# EAGLE design pcb_reguladores (EAGLE 9.6.2)
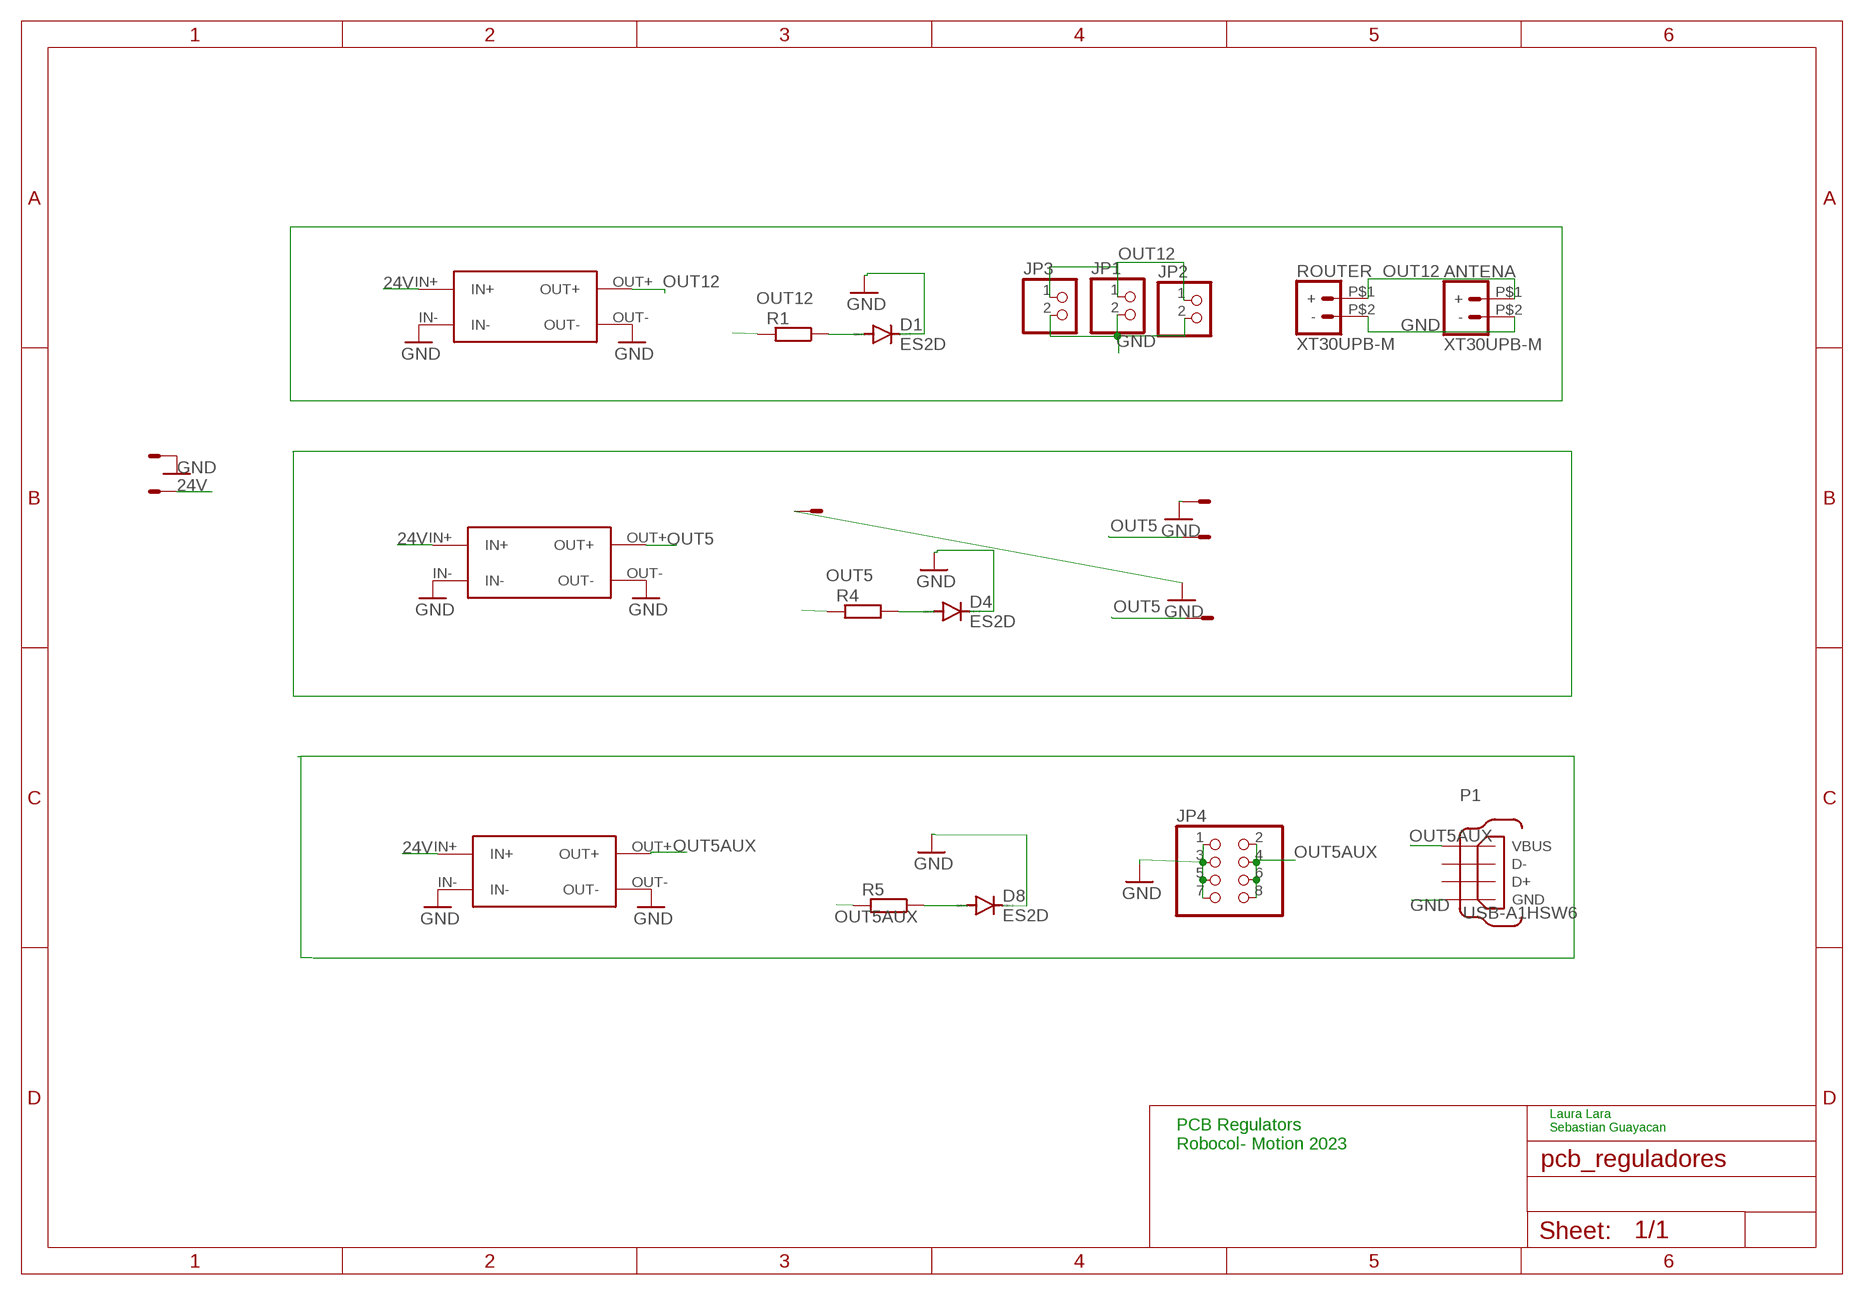
[diagram p0: schematic, sheet 1]

## Parts
ANTENA  XT30UPB-M  [XT30UPB-M]
D1  ES2D  [SMB]
D4  ES2D  [SMB]
D8  ES2D  [SMB]
JP1  PINHD-1X2  [1X02]
JP2  PINHD-1X2  [1X02]
JP3  PINHD-1X2  [1X02]
JP4  PINHD-2X4  [2X04]
P1  USB-A1HSW6  [OST_USB-A1HSW6]
R1  SMK  [SMK]
R4  SMK  [SMK]
R5  SMK  [SMK]
REG5AUX  XL4015_5A  [XL4015_PADS]
REG5V  XL4015_5A  [XL4015_PADS]
REG12V  XL4015_5A  [XL4015_PADS]
ROUTER  XT30UPB-M  [XT30UPB-M]
V_IN  5566-25569-2  [5569-2]
X1  5566-25569-2  [5569-2]
X3  5566-25569-2  [5569-2]

## Nets
24V: REG5AUX.IN+ REG5V.IN+ REG12V.IN+ V_IN.2
GND: ANTENA.P$2(-) D1.C D4.C D8.C JP4.1 JP4.3 JP4.5 JP4.7 P1.4(GND) REG5AUX.IN- REG5AUX.OUT- REG5V.IN- REG5V.OUT- REG12V.IN- REG12V.OUT- ROUTER.P$2(-) V_IN.1 X1.1 X3.1
N$6: JP1.2 JP2.2 JP3.2
N$8: D4.A R4.1
N$13: D1.A R1.1
N$20: D8.A R5.1
OUT5: R4.2 REG5V.OUT+ X1.2 X3.2
OUT5AUX: JP4.2 JP4.4 JP4.6 JP4.8 P1.1(VBUS) R5.2 REG5AUX.OUT+
OUT12: ANTENA.P$1(+) JP1.1 JP2.1 JP3.1 R1.2 REG12V.OUT+ ROUTER.P$1(+)
Unconnected: P1.2(D-) P1.3(D+)

## Notes on the sheet
- Laura Lara
  Sebastian Guayacan
- PCB Regulators 
  Robocol- Motion 2023

## Library data of the parts
ANTENA ROUTER = XT30UPB-M:XT30UPB-M: Check availability <https://pricing.snapeda.com/parts/XT30UPB-M/amass/view-part?ref=eda>; AVAILABILITY: Not in stock; DESCRIPTION: Socket; DC supply; XT30; male; PIN: 2; on PCBs; THT; yellow; 15A; 500V; MF: amass; MP: XT30UPB-M; PACKAGE: None; PRICE: None
D1 D4 D8 = diode:ES2D: DIODE super fast rectifier, 2 A
JP1-JP3 = pinhead:PINHD-1X2: PIN HEADER
JP4 = pinhead:PINHD-2X4: PIN HEADER
P1 = USB-A1HSW6:USB-A1HSW6: USB - A Receptacle Connector 4 Position Through Hole, Right Angle Check availability <https://pricing.snapeda.com/parts/USB-A1HSW6/On%20Shore/view-part?ref=eda>; AVAILABILITY: In Stock; DESCRIPTION: USB-A (USB TYPE-A) - Receptacle Connector 4 Position Through Hole, Right Angle; MF: On Shore; MP: USB-A1HSW6; PACKAGE: None; PRICE: None; PURCHASE-URL: https://pricing.snapeda.com/search/part/USB-A1HSW6/?ref=eda
R1 R4 R5 = resistor-shunt:SMK: SMD SHUNT RESISTOR; OC_FARNELL: unknown; OC_NEWARK: unknown
REG5AUX REG5V REG12V = Robocol_Eagle_Libraries2:XL4015_5A: XL4015 DC-DC Adjustable PSU Module Reference: XL4015 Type: Buck converter. Description: Buck converte step down regulator with up to 5A. Regulador type: Step down. Rated Current: 5A (with heatsink) Voltage in: 8 to 36 VDC Voltage out: 1.23 to 32 VDC Efficiency: Up to 96%. Dimensions: 43.6mm x 21mm x 14mm. Author: Franz Luepke. Year: 2021 Made for use in: Robocol Uniandes.
V_IN X1 X3 = molex_arreglo:5566-2: Mini FIT connector 2 pol Source: http://www.molex.com

## Board
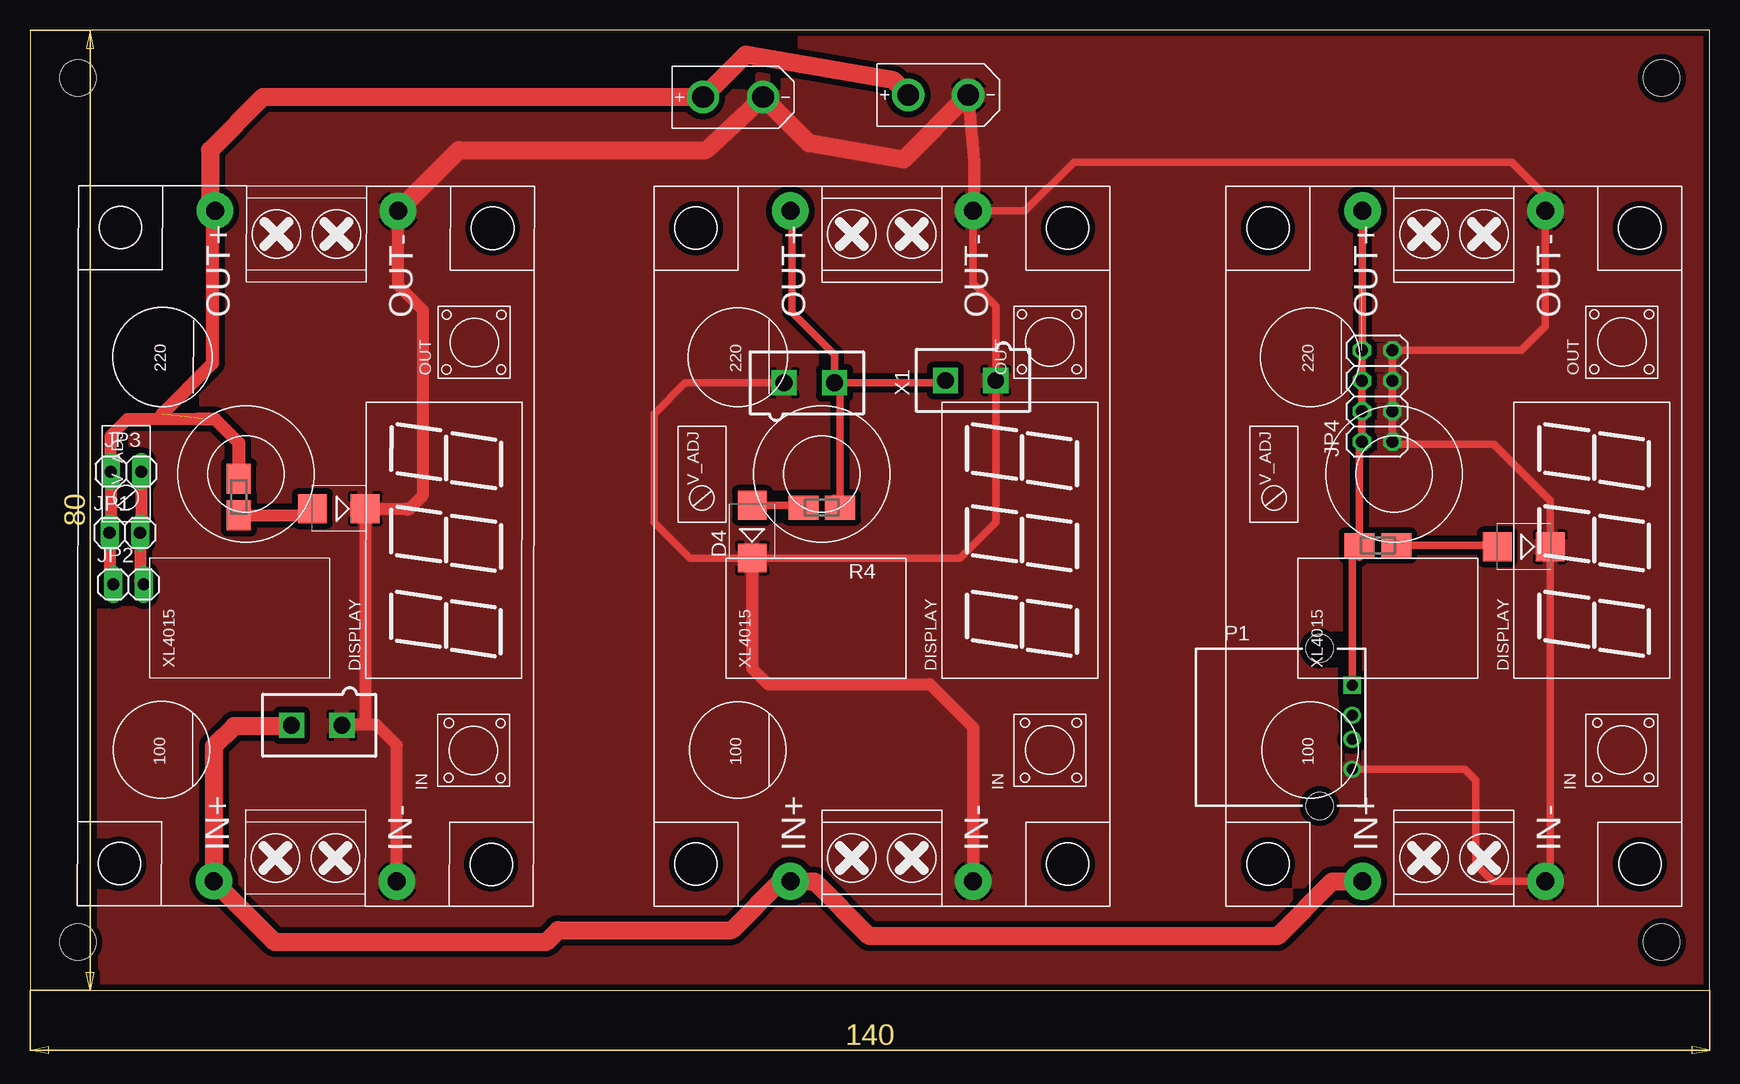
[diagram p1: board, top side]
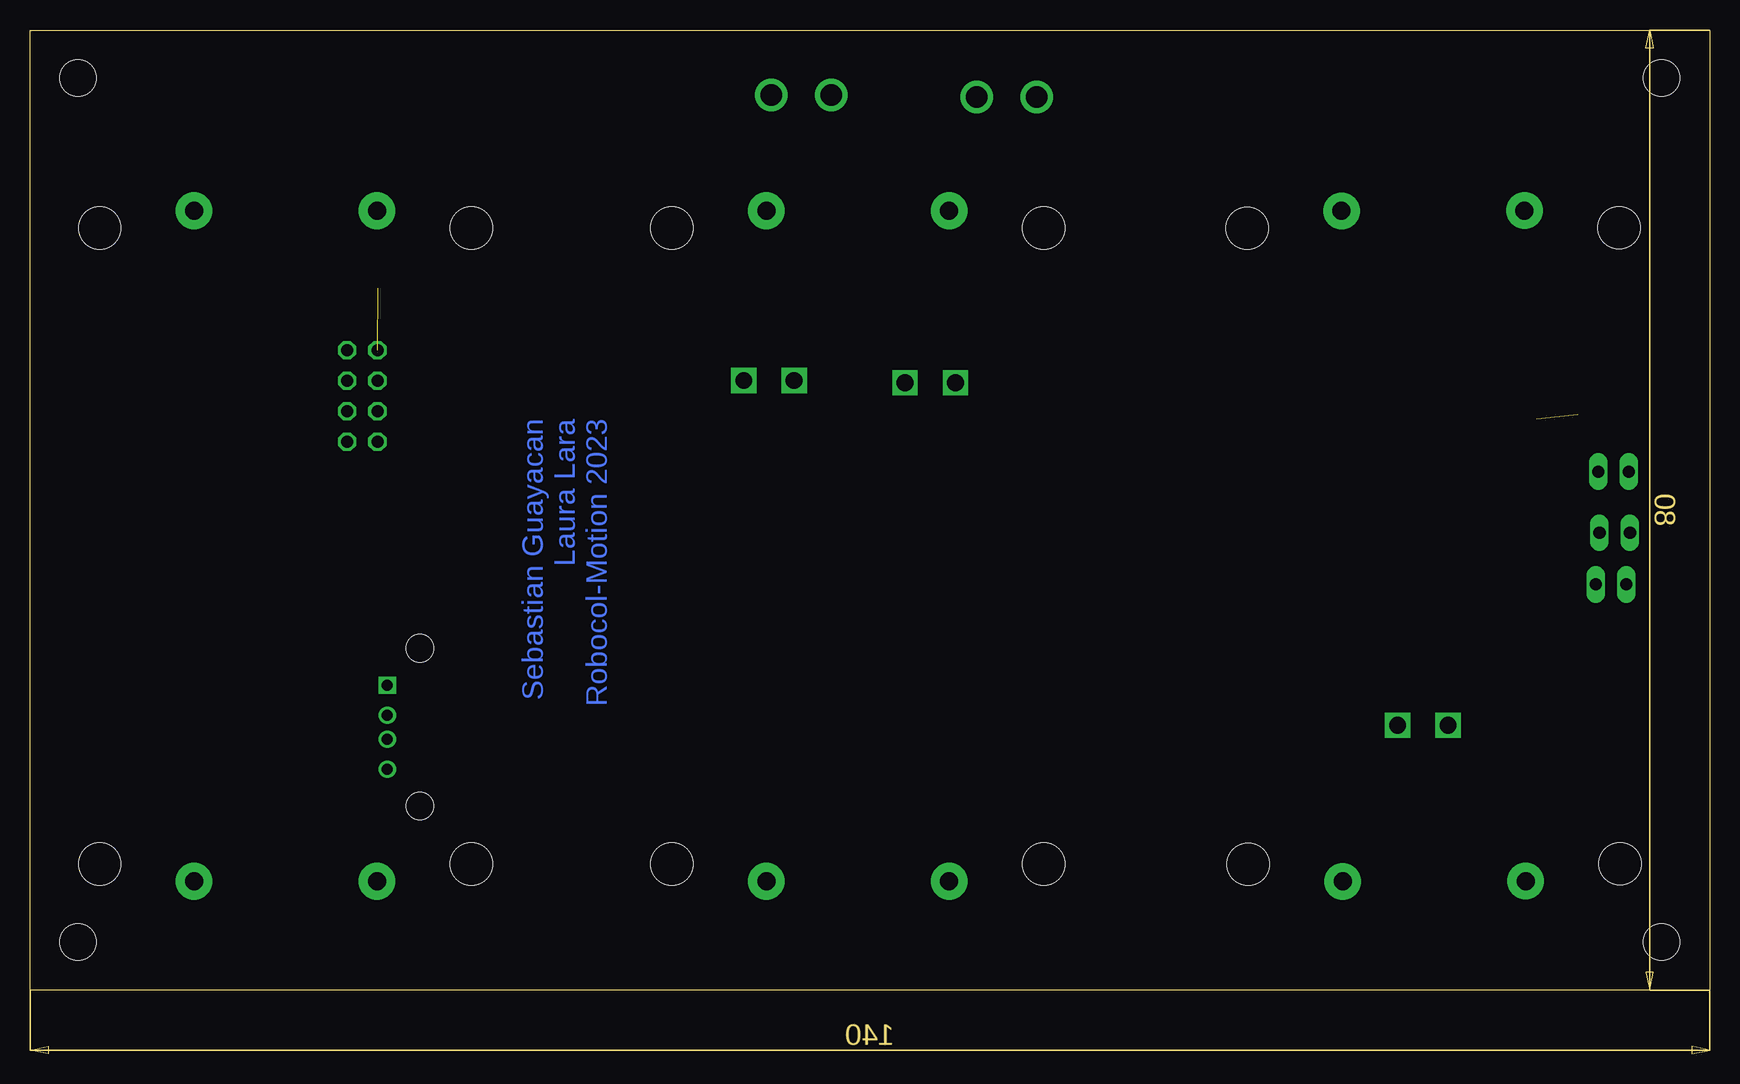
[diagram p2: board, bottom side, seen from below]

Size 140 x 80 mm. Coordinates in mm from the lower left corner, seen from the top.
Outline: 0,0 140,0 140,80 0,80 0,0
Copper layers (1*16): Top 0.035mm / dielectric 1.5mm / Bottom 0.035mm
Design rules "default *": minimum track width 6mil, minimum drill 0.35mm, track to track 0.5mm, track to pad 0.5mm, pad to pad 0.5mm, via to via 0.5mm, smd to smd 0.5mm, copper to edge 0.5mm, drill to drill 0.5mm, minimum pad ring 10mil, minimum via ring 8mil, stop-mask expansion 4mil, vias tented up to drill 0mil, thermal gap 10mil
Holes 3 mm at 4,76 4,4 136,76 136,4

### Footprints (pad centres in the part's own frame; a part is rotated, then mirrored left to right if it is on the bottom)
XT30UPB-M = drill 1.8: P$1 -2.5,0; P$2 2.5,0
SMB = smd 2.4 x 2.4: A 2.2,0; C -2.2,0
1X02 = drill 1.016 long: 1 -1.27,0; 2 1.27,0
2X04 = drill 1.016 octagon: 1 -3.81,-1.27; 2 -3.81,1.27; 3 -1.27,-1.27; 4 -1.27,1.27; 5 1.27,-1.27; 6 1.27,1.27; 7 3.81,-1.27; 8 3.81,1.27
OST_USB-A1HSW6 = drill 0.92 square: 1 -3.5,6.51 | drill 0.92: 2 -1,6.51; 3 1,6.51; 4 3.5,6.51 | hole 2.3: -6.57,3.8; 6.57,3.8
SMK = smd 2.5 x 2: 1 1.524,0; 2 -1.524,0
XL4015_PADS = drill 1.5 pad 3.048: IN+ -27.94,7.62; IN- -27.94,-7.62; OUT+ 27.94,7.62; OUT- 27.94,-7.62 | hole 3.5: -26.5,15.5; 26.5,15.5; 26.5,-15.5; -26.5,-15.5
5569-2 = drill 1.4 square: 1 0,-2.1; 2 0,2.1

### Placement (x,y rotation side)
ANTENA  75.7,74.6 0 top
D1  25.75,40.12 180 top
D4  60.2,38.2 90 top
D8  124.52,36.94 180 top
JP1  7.9,38.1 0 top
JP2  8.2,33.8 0 top
JP3  8,43.2 0 top
JP4  112.3,49.5 90 top
P1  103.7,21.9 270 top
R1  17.4,41.08 270 top
R4  66,40.2 180 top
R5  112.35,37.05 0 top
REG5AUX  118.7,37 90 top
REG5V  71,37 90 top
REG12V  23,37 89.9 top
ROUTER  58.6,74.4 0 top
V_IN  23.9,22.06 90 top
X1  78.4,50.8 90 top
X3  64.96,50.6 270 top

### Tracks (layer width: path | path; a pad name or v marks a point on that pad's centre or on a via)
24V
  Top 1.016: V_IN.2 21.74,22 | REG5V.IN+ 62.56,9.06
  Top 1.5: 21.74,22 17,22 15.33,20.33 REG12V.IN+ 20.41,4 43,4 44,5 58.5,5 62.56,9.06 | REG5V.IN+ 65.38,9.06 69.94,4.5 104,4.5 108.56,9.06 REG5AUX.IN+
GND
  Top 0.61: X3.1 54.6,50.6 52,48 52,39 55,36 D4.C 77.5,36 80.5,39 X1.1 80.5,57 78.62,58.88 REG5V.OUT- 82.94,64.94 87,69 123.5,69 126.32,66.18 REG5AUX.OUT- 126.32,55.32 124.31,53.31 JP4.7 JP4.5 JP4.3 JP4.1 113.76,45.5 122,45.5 126.72,40.78 D8.C 126.72,9.46 REG5AUX.IN- 121.94,9.06 120.5,10.5 120.5,17.5 119.6,18.4 P1.4 | 78.62,60 78.62,59.88
  Top 1.016: REG12V.OUT- 30.67,58.73 32.75,56.65 32.75,41.25 31.5,40 31.39,40.12 D1.C 27.95,22.11 | ANTENA.P$2 78.7,69.1 78.7,65.02 | D4.C 60.2,26.8 61.5,25.5 75,25.5 78.62,21.88 REG5V.IN- | V_IN.1 25.95,22.11 27.95,22.11 | REG12V.IN- 30.57,20.43 28.89,22.11 27.95,22.11
  Top 1.5: ANTENA.P$2 72.8,69.2 64.94,70.56 ROUTER.P$2 56.33,70 35.74,70 REG12V.OUT-
  pour Top: 0,80 140,80 140,0 0,0
N$6
  Top 1.016: JP3.2 9.27,38.2 JP1.2 9.17,34.1 JP2.2
N$8
  Top 0.61: R4.1 64.28,40.4 D4.A 60.7,40.9
N$13
  Top 1.016: R1.1 22.99,39.55 D1.A
N$20
  Top 0.61: R5.1 122.21,37.05 D8.A
OUT5
  Top 0.61: REG5V.OUT+ 63.5,64.82 63.5,56.5 67.06,52.94 X3.2 | X3.2 67.52,50.14 R4.2 67,40.72 67,41 | X3.2 76.1,50.6 X1.2
OUT5AUX  (1 unrouted)
  Top 0.61: 111.08,58.58 111,58.5 | REG5AUX.OUT+ 111.08,53.36 JP4.8 JP4.6 JP4.4 JP4.2 110.83,45.49 R5.2 | R5.2 110.83,36.05 | R5.2 110.21,36.43 P1.1
OUT12  (1 unrouted)
  Top 1.016: ROUTER.P$1 58.5,77 | 14.4,47.6 14,47.6 8.13,47.6 6.73,46.2 JP3.1 6.73,38.2 JP1.1 6.63,34.1 JP2.1
  Top 1.1: 14,47.6 15.4,47.6 17.4,45.6 R1.2 | REG12V.OUT+ 15.19,64.72 15.19,52.19 11,48
  Top 1.5: ANTENA.P$1 71.99,75.81 59.65,77.95 ROUTER.P$1 19.4,74.4 15,70 15,65.38 REG12V.OUT+

### Text on the board
Bottom: Sebastian Guayacan / Laura Lara / Robocol-Motion 2023